# Altium schematic sheet 5V Regulator.SchDoc
size A
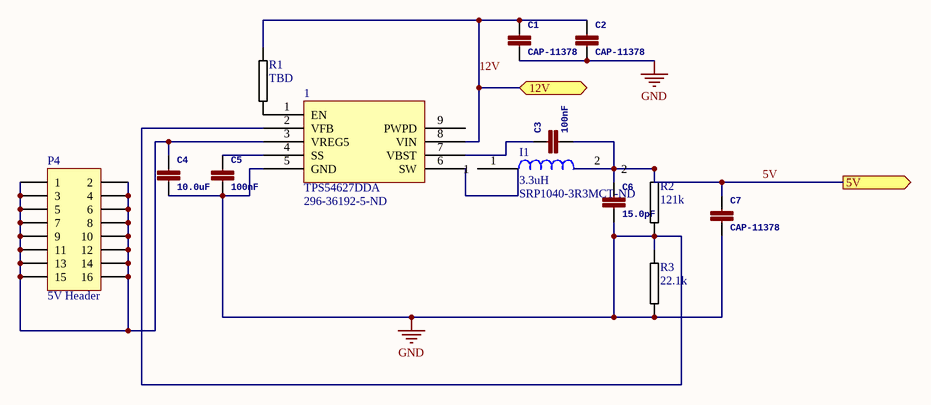
[diagram p0: 5V Regulator.SchDoc]

## Parts
1  TPS54627DDA  Supplier Part Number 1: 296-36192-5-ND  [SOIC127P600X170_HS-9N]
C1  CAP-11378  [0603]
C2  CAP-11378  [0603]
C3  100nF  [0603]
C4  10.0uF  [0603]
C5  100nF  [0603]
C6  15.0pF  [0603]
C7  CAP-11378  [0603]
I1  3.3uH  Supplier Part Number 1: SRP1040-3R3MCT-ND  [SRP1040]
P4  5V Header  [HDR2X8H]
R1  TBD  [0402R-TBD]
R2  121k  [0402R-TBD]
R3  22.1k  [0402R-TBD]

## Ports
5V (out), 12V

## Nets
GND: 1.2(VFB) 1.5(GND) C1.2 C2.2 C4.2 C5.2 C6.2 C7.2 R2.2 R3.1 R3.2
5V: C3.2 C6.1 C7.1 I1.2 R2.1 ; port 5V
12V: 1.8(VIN) C1.1 C2.1 R1.1 ; port 12V
Net1_1: 1.1(EN) R1.2
Net1_3: 1.3(VREG5) C4.1 P4.1 P4.2 P4.3 P4.4 P4.5 P4.6 P4.7 P4.8 P4.9 P4.10 P4.11 P4.12 P4.13 P4.14 P4.15 P4.16
Net1_4: 1.4(SS) C5.1
Net1_6: 1.6(SW) I1.1
Net1_7: 1.7(VBST) C3.1

Not connected (* = marked no-connect by the designer): 1 9(PWPD)

## Library data of the parts
1 = TPS54627DDA: IC REG BUCK ADJ 6A SYNC 8SOPWR; Manufacturer: Texas Instruments; Function: Step-Down; Output Configuration: Positive; Output Type: Adjustable; Number of Outputs: 1; Voltage - Input (Min): 4.5V; Voltage - Input (Max): 18V; Voltage - Output (Min/Fixed): 0.765V; Voltage - Output (Max): 5.5V; Frequency - Switching: 650kHz; Synchronous Rectifier: Yes; Supplier 1: Digi-Key; Manufacturer Part Number: TPS54627DDA; RoHS: RoHS Compliant; Category: Integrated Circuits (ICs); Stock 1: 282; Pricing 1: 1=2.94, 10=2.639, 100=2.1626, 500=1.84094, 1000=1.5526 (USD); Packaging: Tube; Part Status: Active; Topology: Buck; Current - Output: 6A; Operating Temperature: -40°C ~ 85°C (TA); Mounting Type: Surface Mount; Package / Case: 8-PowerSOIC (0.154", 3.90mm Width); Supplier Device Package: 8-SO PowerPad; Base Part Number: TPS54627; ComponentLink1URL: http://www.ti.com/lit/ds/symlink/tps54627.pdf; ComponentLink1Description: http://www.ti.com/lit/ds/symlink/tps54627.pdf
C1 C2 C7 = 4.7NF-50V-10%(0603): PROD_ID: CAP-11378
C3-C6 = 4.7NF-50V-10%(0603): PROD_ID: CAP-11378
I1 = SRP1040-3R3M: FIXED IND 3.3UH 10A 10 MOHM SMD; Manufacturer: Bourns Inc.; Material - Core: Iron; Tolerance: ±20%; Shielding: Shielded; DC Resistance (DCR): 10 mOhm Max; Supplier 1: Digi-Key; Manufacturer Part Number: SRP1040-3R3M; RoHS: RoHS Compliant; Category: Inductors, Coils, Chokes; Stock 1: 575; Pricing 1: 1=1.43, 10=1.32, 100=0.9237 (USD); Packaging: Cut Tape (CT); Part Status: Active; Type: -; Q @ Freq: -; Ratings: -; Operating Temperature: -55°C ~ 150°C; Mounting Type: Surface Mount; Package / Case: Nonstandard; Supplier Device Package: -; Size / Dimension: 0.465" L x 0.413" W (11.80mm x 10.50mm); Height - Seated (Max): 0.165" (4.20mm); ComponentLink1URL: http://www.bourns.com/docs/Product-Datasheets/SRP1040.pdf; ComponentLink1Description: http://www.bourns.com/docs/Product-Datasheets/SRP1040.pdf
P4 = Header 8X2H: Header, 8-Pin, Dual row, Right Angle; LatestRevisionDate: 17-Jul-2002; LatestRevisionNote: Re-released for DXP Platform.; Publisher: Altium Limited
R1-R3 = 0402R-TBD: RESISTOR 0402 VALUE TO BE DETERMINED